# Altium schematic sheet SCH FILTER.SchDoc
size A4
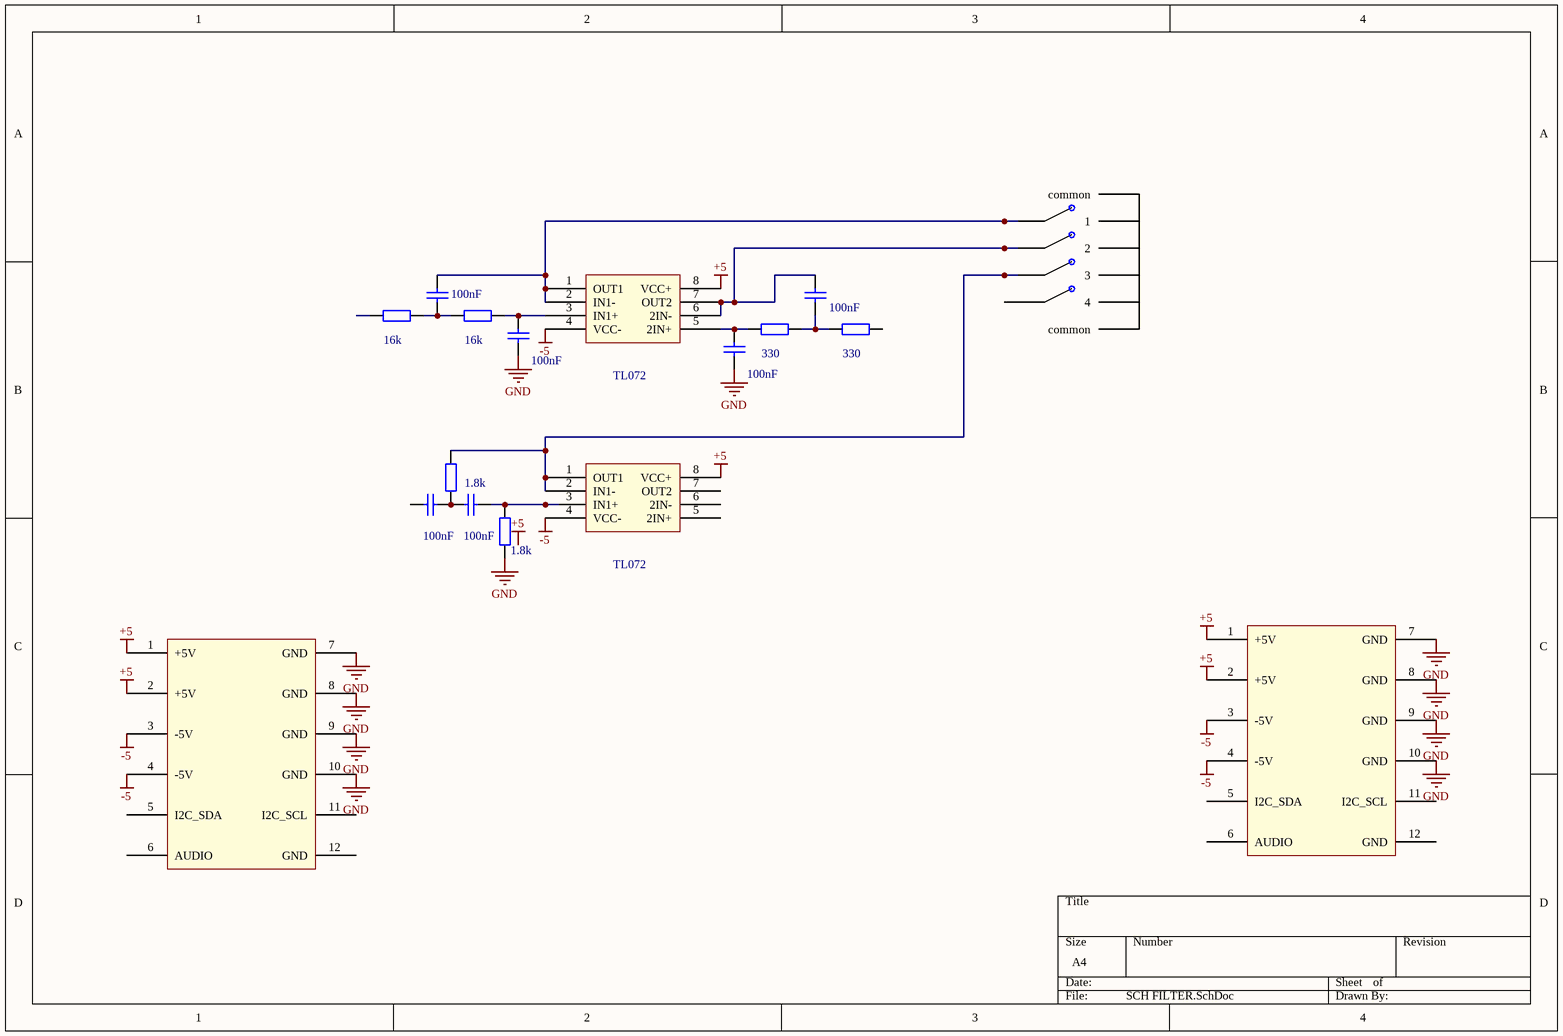
[diagram p0: SCH FILTER.SchDoc]

## Parts
(Parts that share a designator on the sheet are numbered #1, #2 ... from top to bottom, then left to right.)
*  Component_1  (value not drawn)
*?  Component_1  (value not drawn)
?  common  [bs1470]  (value not drawn)
C?#1  value 100nF  [RAD-0.3]  (hidden comment: Cap)
C?#2  value 100nF  [RAD-0.3]  (hidden comment: Cap)
C?#3  value 100nF  [RAD-0.3]  (hidden comment: Cap)
C?#4  value 100nF  [RAD-0.3]  (hidden comment: Cap)
C?#5  value 100nF  [RAD-0.3]  (hidden comment: Cap)
C?#6  value 100nF  [RAD-0.3]  (hidden comment: Cap)
R?#1  value 16k  [AXIAL-0.4]  (hidden comment: Res2)
R?#2  value 16k  [AXIAL-0.4]  (hidden comment: Res2)
R?#3  value 330  [AXIAL-0.4]  (hidden comment: Res2)
R?#4  value 330  [AXIAL-0.4]  (hidden comment: Res2)
R?#5  value 1.8k  [AXIAL-0.4]  (hidden comment: Res2)
R?#6  value 1.8k  [AXIAL-0.4]  (hidden comment: Res2)
U?#1  TL072  [DIP794W45P254L1060H508Q8]  (part A of 2)
U?#2  TL072  [DIP794W45P254L1060H508Q8]  (part A of 2)

## Nets
+5: *.1(+5V) *.2(+5V) *?.1(+5V) *?.2(+5V) U?#1.8(VCC+) U?#2.8(VCC+)
-5: *.3(-5V) *.4(-5V) *?.3(-5V) *?.4(-5V) U?#1.4(VCC-) U?#2.4(VCC-)
GND: *.7(GND) *.8(GND) *.9(GND) *.10(GND) *?.7(GND) *?.8(GND) *?.9(GND) *?.10(GND) C?#3.1 C?#4.1 R?#6.1
Net?_16: ?.16 C?#1.2 U?#1.1(OUT1) U?#1.2(IN1-)
Net?_17: ?.17 C?#2.2 U?#1.6(2IN-) U?#1.7(OUT2)
Net?_18: ?.18 R?#5.1 U?#2.1(OUT1) U?#2.2(IN1-)
NetC?#1_1: C?#1.1 R?#1.2 R?#2.1
NetC?#2_1: C?#2.1 R?#3.2 R?#4.1
NetC?#3_2: C?#3.2 R?#2.2 U?#1.3(IN1+)
NetC?#4_2: C?#4.2 R?#3.1 U?#1.5(2IN+)
NetC?#5_1: C?#5.1 C?#6.2 R?#5.2
NetC?#6_1: C?#6.1 R?#6.2 U?#2.3(IN1+)

Not connected (* = marked no-connect by the designer): * 5(I2C_SDA) 6(AUDIO) 11(I2C_SCL) 12(GND); *? 5(I2C_SDA) 6(AUDIO) 11(I2C_SCL) 12(GND); ? 12(2) 13(3) 14(4) 15(common) 19 ?1(common) ?2(1); C?#5 2; R?#1 1; R?#4 2; U?#2 5(2IN+) 6(2IN-) 7(OUT2)

## Notes on the sheet
- Labels drawn without touching a wire or pin: +5

## Library data of the parts
C?#1-C?#6 = Cap: Capacitor; Published: 8-Jun-2000; LatestRevisionDate: 17-Jul-2002; LatestRevisionNote: Re-released for DXP Platform.; PackageReference: RAD-0.3; Publisher: Altium Limited; PackageDescription: Radial Cap, Thru-Hole; 2 Leads; 0.3 in Pin Spacing
R?#1-R?#6 = Res2: Resistor; Published: 8-Jun-2000; LatestRevisionDate: 17-Jul-2002; LatestRevisionNote: Re-released for DXP Platform.; PackageReference: AXIAL-0.4; Publisher: Altium Limited; PackageDescription: Axial Device, Thru-Hole; 2 Leads; 0.4 in Pin Spacing
U?#1 U?#2 = TL072: Wide Bandwidth Dual JFET Input Operational Amplifier 8-PDIP 0 to 70; MF: Texas Instruments; Price: None; MP: TL072; SnapEDA_Link: https://www.snapeda.com/parts/TL072/Texas%2520Instruments/view-part/?ref=snap; Package: None; Availability: Unavailable; Value: *